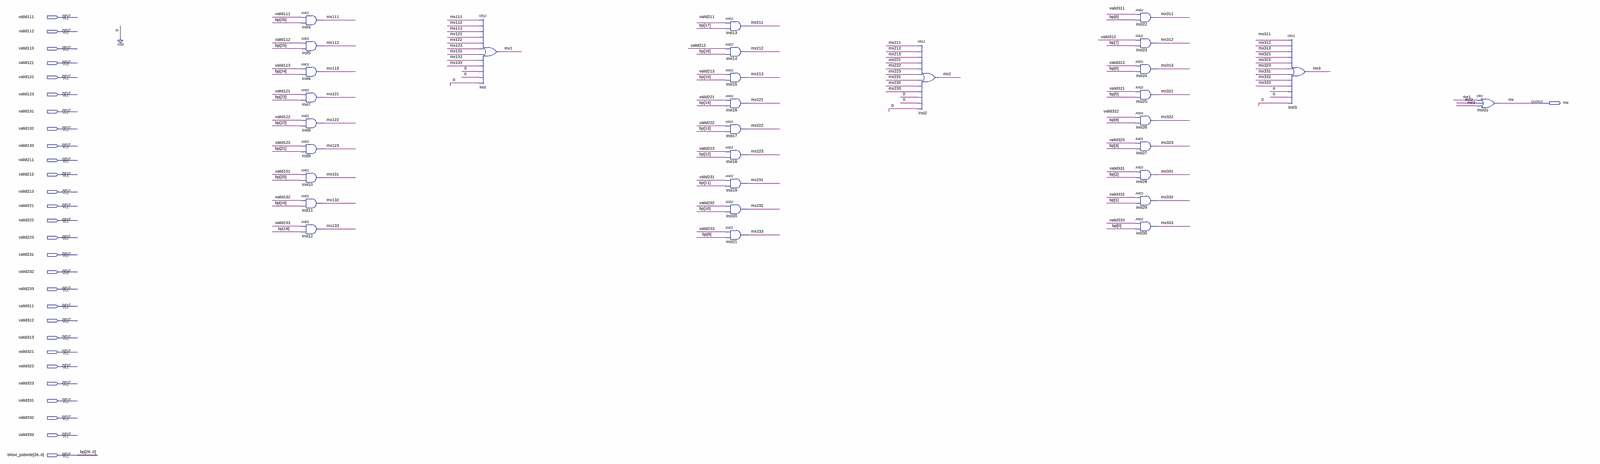
[diagram p0: schematic sheet, whole]
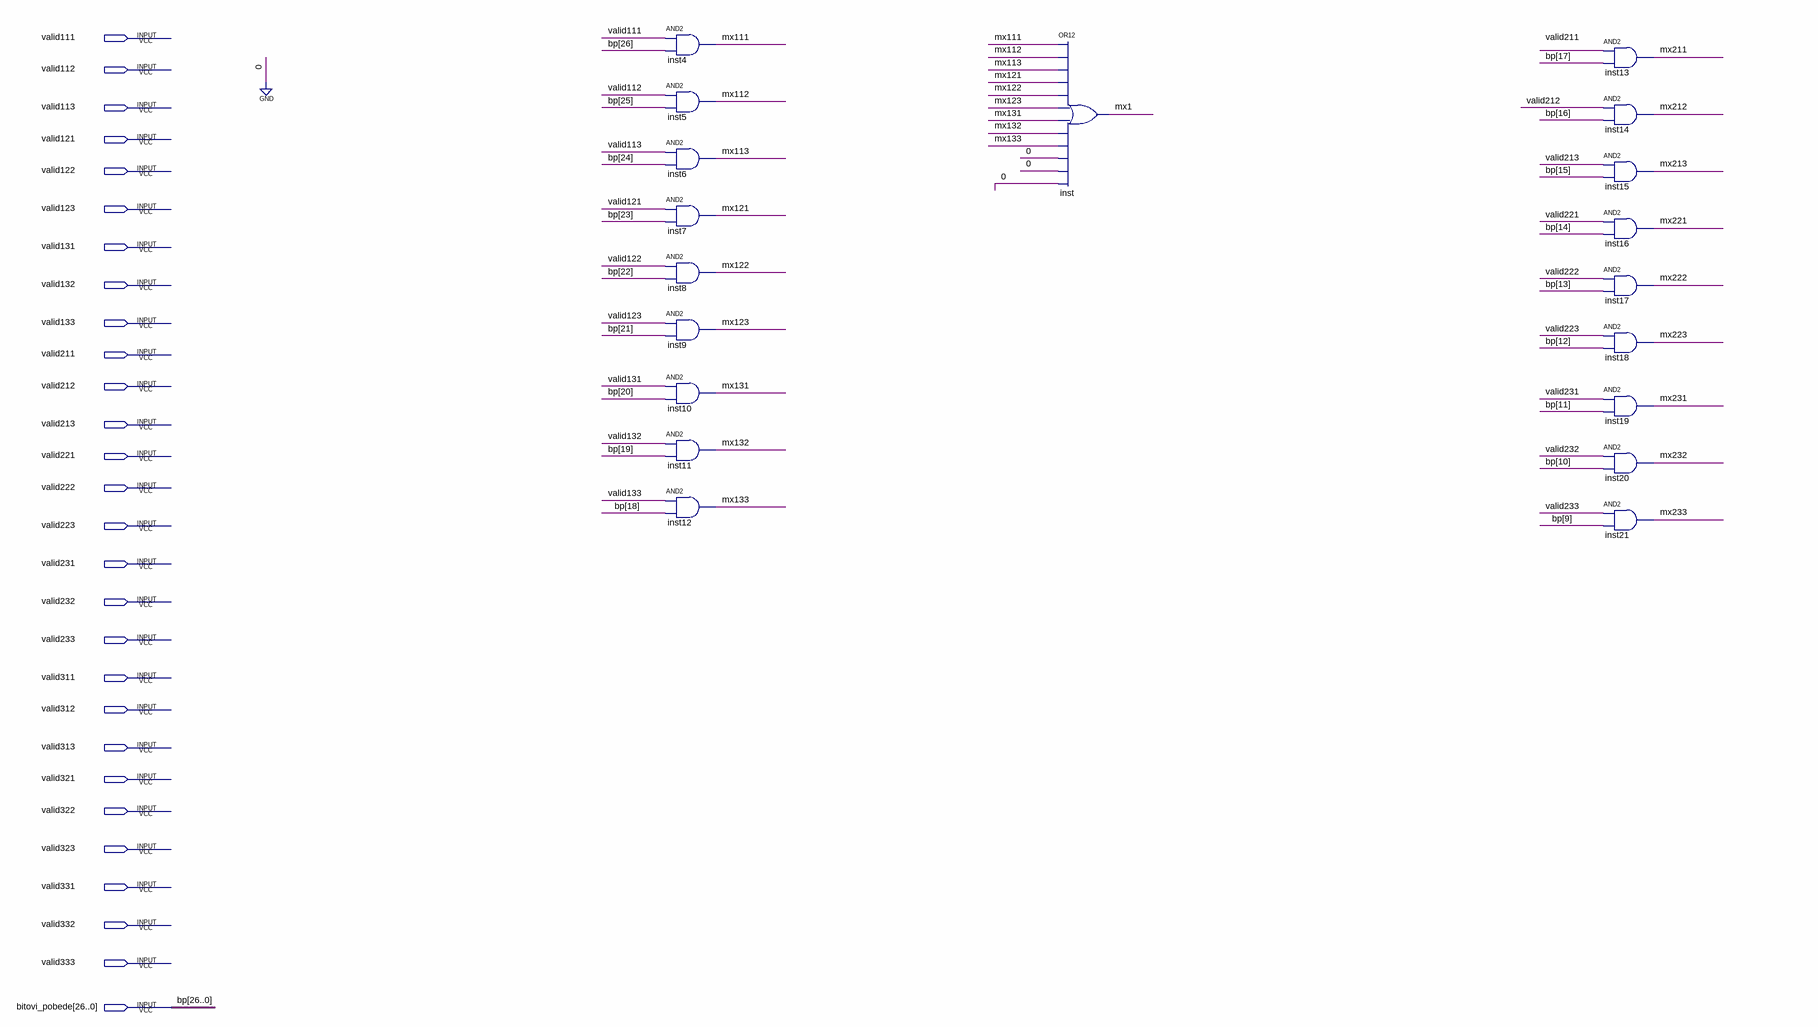
[diagram p1: schematic sheet, left part]
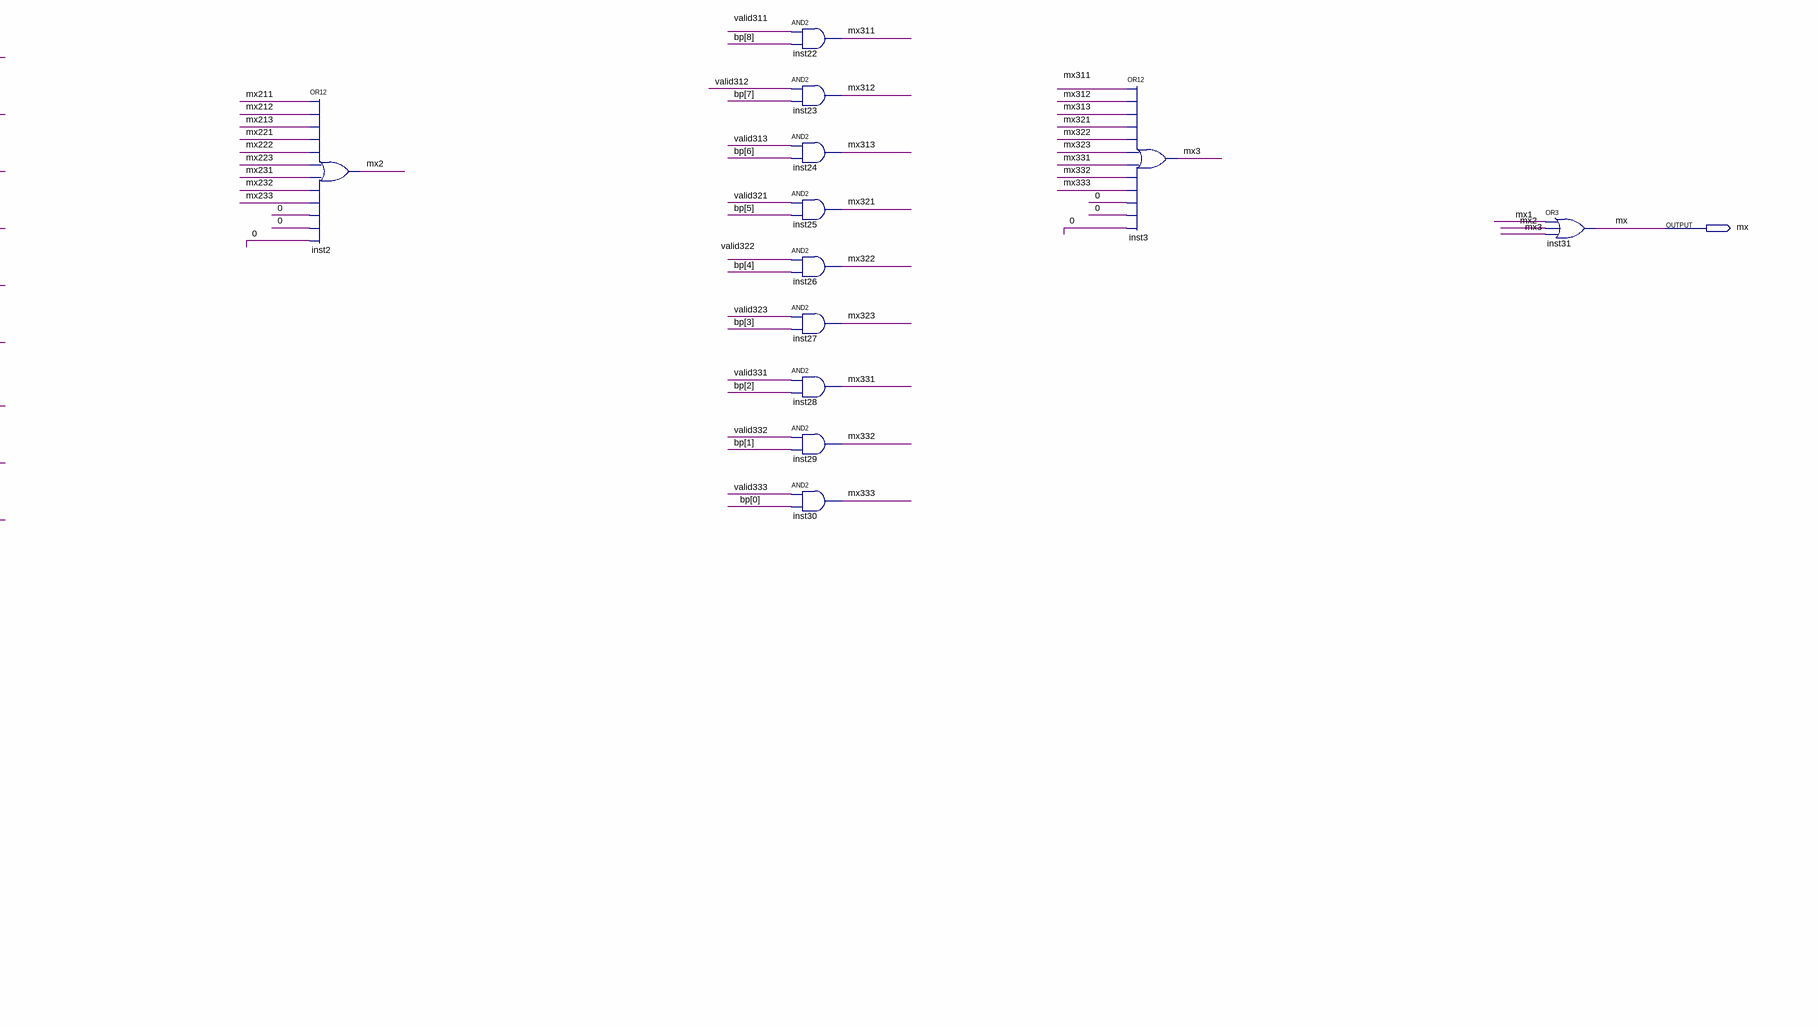
[diagram p2: schematic sheet, right part]
// Quartus schematic PoljePobede.bdf as structural Verilog: 31 symbols, 29 pins
module PoljePobede (
  input  valid111,
  input  valid112,
  input  valid113,
  input  valid121,
  input  valid122,
  input  valid123,
  input  valid131,
  input  valid132,
  input  valid133,
  input  valid211,
  input  valid212,
  input  valid213,
  input  valid221,
  input  valid222,
  input  valid223,
  input  valid231,
  input  valid232,
  input  valid233,
  input  valid311,
  input  valid312,
  input  valid313,
  input  valid321,
  input  valid322,
  input  valid323,
  input  valid331,
  input  valid332,
  input  valid333,
  input  [26:0] bitovi_pobede,
  output mx
);

  wire mx1, mx2, mx3, mx111, mx112, mx113, mx121, mx122, mx123, mx131, mx132, mx133, mx211, mx212, mx213,
       mx221, mx222, mx223, mx231, mx232, mx233, mx311, mx312, mx313, mx321, mx322, mx323, mx331, mx332,
       mx333;

  and inst4 (mx111, valid111, bitovi_pobede[26]);
  and inst5 (mx112, valid112, bitovi_pobede[25]);
  and inst6 (mx113, valid113, bitovi_pobede[24]);
  and inst7 (mx121, valid121, bitovi_pobede[23]);
  and inst8 (mx122, valid122, bitovi_pobede[22]);
  and inst9 (mx123, valid123, bitovi_pobede[21]);
  and inst10 (mx131, valid131, bitovi_pobede[20]);
  and inst11 (mx132, valid132, bitovi_pobede[19]);
  and inst12 (mx133, valid133, bitovi_pobede[18]);
  or inst (mx1, mx111, mx112, mx113, mx121, mx122, mx123, mx131, mx132, mx133, 1'b0, 1'b0, 1'b0);
  and inst13 (mx211, valid211, bitovi_pobede[17]);
  and inst14 (mx212, valid212, bitovi_pobede[16]);
  and inst15 (mx213, valid213, bitovi_pobede[15]);
  and inst16 (mx221, valid221, bitovi_pobede[14]);
  and inst17 (mx222, valid222, bitovi_pobede[13]);
  and inst18 (mx223, valid223, bitovi_pobede[12]);
  and inst19 (mx231, valid231, bitovi_pobede[11]);
  and inst20 (mx232, valid232, bitovi_pobede[10]);
  and inst21 (mx233, valid233, bitovi_pobede[9]);
  or inst2 (mx2, mx211, mx212, mx213, mx221, mx222, mx223, mx231, mx232, mx233, 1'b0, 1'b0, 1'b0);
  and inst22 (mx311, valid311, bitovi_pobede[8]);
  and inst23 (mx312, valid312, bitovi_pobede[7]);
  and inst24 (mx313, valid313, bitovi_pobede[6]);
  and inst25 (mx321, valid321, bitovi_pobede[5]);
  and inst26 (mx322, valid322, bitovi_pobede[4]);
  and inst27 (mx323, valid323, bitovi_pobede[3]);
  and inst28 (mx331, valid331, bitovi_pobede[2]);
  and inst29 (mx332, valid332, bitovi_pobede[1]);
  and inst30 (mx333, valid333, bitovi_pobede[0]);
  or inst3 (mx3, mx311, mx312, mx313, mx321, mx322, mx323, mx331, mx332, mx333, 1'b0, 1'b0, 1'b0);
  or inst31 (mx, mx1, mx2, mx3);

  // Other names for the same wires on the sheet: bp[26:0] = bitovi_pobede
endmodule
